# EAGLE design BLUETOOTH UNIT (EAGLE 9.5.0)
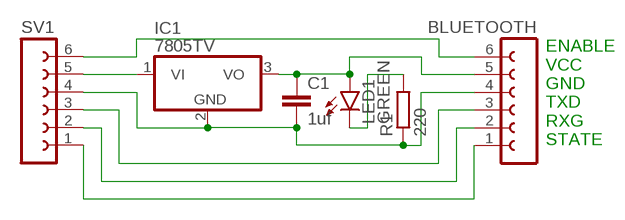
[diagram p0: schematic, sheet 1]

## Parts
BLUETOOTH  FE06-1  [FE06]
C1  1uf  C-EU025-025X050  [C025-025X050]
IC1  7805TV  [TO220V]
LED1  GREEN  LEDSML0805  [SML0805]
R1  220  R-EU_0204/7  [0204/7]
SV1  FE06-1  [FE06]

## Nets
N$1: IC1.1(VI) SV1.5
N$2: BLUETOOTH.4 C1.2 IC1.2(GND) R1.1 SV1.4
N$3: BLUETOOTH.5 C1.1 IC1.3(VO) LED1.A
N$4: LED1.C R1.2
N$5: BLUETOOTH.3 SV1.3
N$6: BLUETOOTH.6 SV1.6
N$7: BLUETOOTH.2 SV1.2
N$8: BLUETOOTH.1 SV1.1

## Notes on the sheet
- ENABLE
  VCC
  GND
  TXD
  RXG
  STATE

## Library data of the parts
BLUETOOTH SV1 = con-lsta:FE06-1: FEMALE HEADER; OC_FARNELL: unknown; OC_NEWARK: unknown
C1 = rcl:C-EU: CAPACITOR, European symbol; SPICEPREFIX: C
IC1 = linear:78*: Positive VOLTAGE REGULATOR Source: http://cache.national.com/ds/LM/LM78L05.pdf http://www.fairchildsemi.com/ds/LM/LM7805.pdf
LED1 = led:LED: LED OSRAM: - CHIPLED LG R971, LG N971, LY N971, LG Q971, LY Q971, LO R971, LY R971 LH N974, LH R974 LS Q976, LO Q976, LY Q976 LO Q996 - Hyper CHIPLED LW Q18S LB Q993, LB Q99A, LB R99A - SideLED LS A670, LO A670, LY A670, LG A670, LP A670 LB A673, LV A673, LT A673, LW A673 LH A674 LY A675 LS A676, LA A676, LO A676, LY A676, LW A676 LS A679, LY A679, LG A679 - Hyper Micro SIDELED® LS Y876, LA Y876, LO Y876, LY Y876 LT Y87S - SmartLED LW L88C, LW L88S LB L89C, LB L89S, LG L890 LS L89K, LO L89K, LY L89K LS L896, LA L896, LO L896, LY L896 - TOPLED LS T670, LO T670, LY T670, LG T670, LP T670 LSG T670, LSP T670, LSY T670, LOP T670, LYG T670 LG T671, LOG T671, LSG T671 LB T673, LV T673, LT T673, LW T673 LH T674 LS T676, LA T676, LO T676, LY T676, LB T676, LH T676, LSB T676, LW T676 LB T67C, LV T67C, LT T67C, LS T67K, LO T67K, LY T67K, LW E67C LS E67B, LA E67B, LO E67B, LY E67B, LB E67C, LV E67C, LT E67C LW T67C LS T679, LY T679, LG T679 LS T770, LO T770, LY T770, LG T770, LP T770 LB T773, LV T773, LT T773, LW T773 LH T774 LS E675, LA E675, LY E675, LS T675 LS T776, LA T776, LO T776, LY T776, LB T776 LHGB T686 LT T68C, LB T68C - Hyper Mini TOPLED® LB M676 - Mini TOPLED Santana® LG M470 LS M47K, LO M47K, LY M47K Source: http://www.osram.convergy.de LUXEON: - LUMILED® LXK2-PW12-R00, LXK2-PW12-S00, LXK2-PW14-U00, LXK2-PW14-V00 LXK2-PM12-R00, LXK2-PM12-S00, LXK2-PM14-U00 LXK2-PE12-Q00, LXK2-PE12-R00, LXK2-PE12-S00, LXK2-PE14-T00, LXK2-PE14-U00 LXK2-PB12-K00, LXK2-PB12-L00, LXK2-PB12-M00, LXK2-PB14-N00, LXK2-PB14-P00, LXK2-PB14-Q00 LXK2-PR12-L00, LXK2-PR12-M00, LXK2-PR14-Q00, LXK2-PR14-R00 LXK2-PD12-Q00, LXK2-PD12-R00, LXK2-PD12-S00 LXK2-PH12-R00, LXK2-PH12-S00 LXK2-PL12-P00, LXK2-PL12-Q00, LXK2-PL12-R00 Source: www.luxeon.com KINGBRIGHT: KA-3528ASYC Source: www.kingbright.com
R1 = rcl:R-EU_: RESISTOR, European symbol; SPICEPREFIX: R

## Board
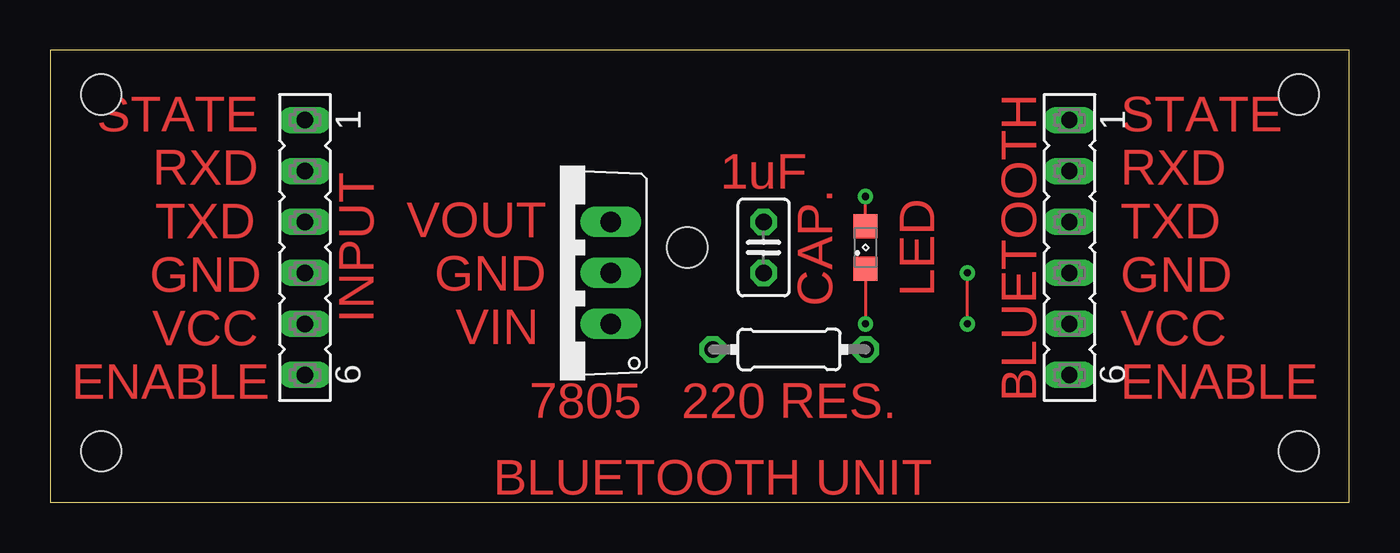
[diagram p1: board, top side]
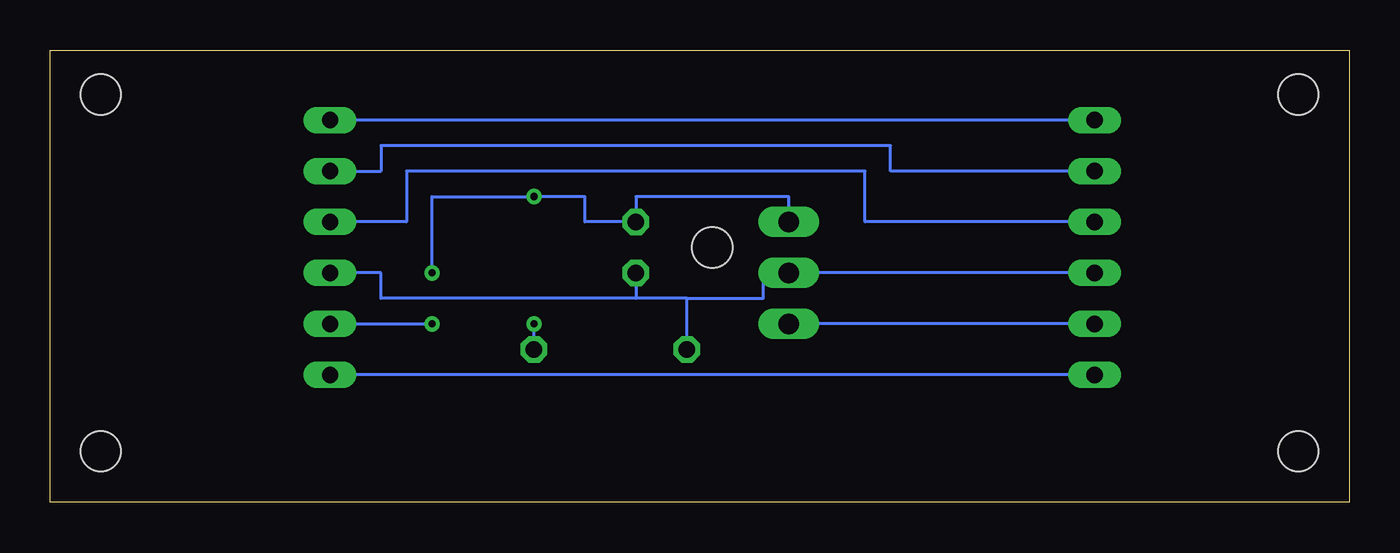
[diagram p2: board, bottom side, seen from below]

Size 64.75 x 22.53 mm. Coordinates in mm from the lower left corner, seen from the top.
Outline: 0,0 64.75,0 64.75,22.53 0,22.53 0,0
Copper layers (1*16): Top 0.035mm / dielectric 1.5mm / Bottom 0.035mm
Design rules "default": minimum track width 6mil, minimum drill 0.35mm, track to track 6mil, track to pad 6mil, pad to pad 6mil, via to via 6mil, smd to smd 6mil, copper to edge 40mil, drill to drill 6mil, minimum pad ring 10mil, minimum via ring 8mil, stop-mask expansion 4mil, vias tented up to drill 0mil, thermal gap 10mil
Holes 2 mm at 2.54,2.54 2.54,20.32 62.23,20.32 62.23,2.54 31.75,12.7

### Footprints (pad centres in the part's own frame; a part is rotated, then mirrored left to right if it is on the bottom)
FE06 = drill 0.813 long: 1 -6.35,0; 2 -3.81,0; 3 -1.27,0; 4 1.27,0; 5 3.81,0; 6 6.35,0
C025-025X050 = drill 0.813 octagon: 1 -1.27,0; 2 1.27,0
TO220V = drill 1.016 long: 1 -2.54,-2.54; 2 0,-2.54; 3 2.54,-2.54
SML0805 = smd 1.2 x 1.2: A 1.05,0; C -1.05,0
0204/7 = drill 0.813 octagon: 1 -3.81,0; 2 3.81,0

### Placement (x,y rotation side)
BLUETOOTH  50.8,12.7 270 top
C1  35.56,12.7 270 top
IC1  25.4,11.43 90 top
LED1  40.64,12.7 90 top
R1  36.83,7.62 0 top
SV1  12.7,12.7 270 top

### Tracks (layer width: path | path; a pad name or v marks a point on that pad's centre or on a via)
N$1
  Bottom 0.152: SV1.5 IC1.1
N$2
  Bottom 0.152: SV1.4 IC1.2 29.21,11.43 29.21,10.16 33.02,10.16 | R1.1 33.02,10.16 | 33.02,10.16 35.56,10.16 | 35.56,10.16 48.26,10.16 48.26,11.43 BLUETOOTH.4 | C1.2 35.56,10.16
N$3  (via drill 0.35)
  Top 0.152: LED1.A v40.64,15.24 | v45.72,8.89 v45.72,11.43
  Bottom 0.152: BLUETOOTH.5 v45.72,8.89 | v45.72,11.43 45.72,15.24 v40.64,15.24 38.1,15.24 38.1,13.97 C1.1 35.56,15.24 27.94,15.24 IC1.3
N$4  (via drill 0.35)
  Top 0.152: LED1.C v40.64,8.89
  Bottom 0.152: R1.2 v40.64,8.89
N$5
  Bottom 0.152: BLUETOOTH.3 46.99,13.97 46.99,16.51 24.13,16.51 24.13,13.97 SV1.3
N$6
  Bottom 0.152: SV1.6 BLUETOOTH.6
N$7
  Bottom 0.152: BLUETOOTH.2 48.26,16.51 48.26,17.78 22.86,17.78 22.86,16.51 SV1.2
N$8
  Bottom 0.152: SV1.1 BLUETOOTH.1

### Text on the board
Top: 1uF | STATE / RXD / TXD / GND / VCC / ENABLE | INPUT | CAP. | LED | BLUETOOTH | STATE / RXD / TXD / GND / VCC / ENABLE | VOUT / GND / VIN | 7805 | 220 RES. | BLUETOOTH UNIT